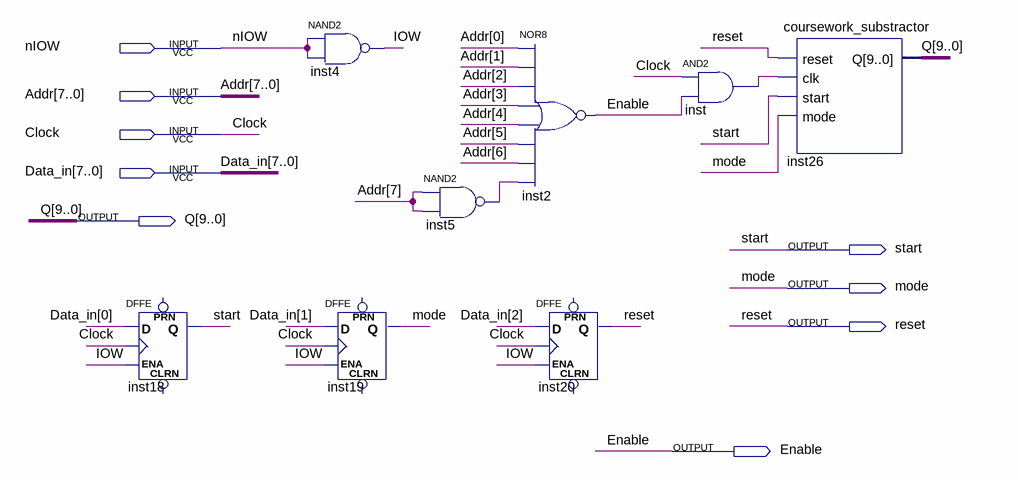
[diagram p0: schematic sheet]
// Quartus schematic coursework_interface.bdf as structural Verilog: 8 symbols, 9 pins
module coursework_interface (
  input  nIOW,
  input  [7:0] Addr,
  input  Clock,
  input  [7:0] Data_in,
  output [9:0] Q,
  output start,
  output mode,
  output reset,
  output Enable
);

  wire inst5_out, inst_out, IOW;

  DFFE inst18 (.D(Data_in[0]), .CLK(Clock), .ENA(IOW), .Q(start));  // open: PRN, CLRN
  nand inst4 (IOW, nIOW, nIOW);
  DFFE inst19 (.D(Data_in[1]), .CLK(Clock), .ENA(IOW), .Q(mode));  // open: PRN, CLRN
  nand inst5 (inst5_out, Addr[7], Addr[7]);
  nor inst2 (Enable, Addr[0], Addr[1], Addr[2], Addr[3], Addr[4], Addr[5], Addr[6], inst5_out);
  DFFE inst20 (.D(Data_in[2]), .CLK(Clock), .ENA(IOW), .Q(reset));  // open: PRN, CLRN
  and inst (inst_out, Clock, Enable);
  coursework_substractor inst26 (.reset(reset), .clk(inst_out), .start(start), .mode(mode), .Q(Q));
endmodule
